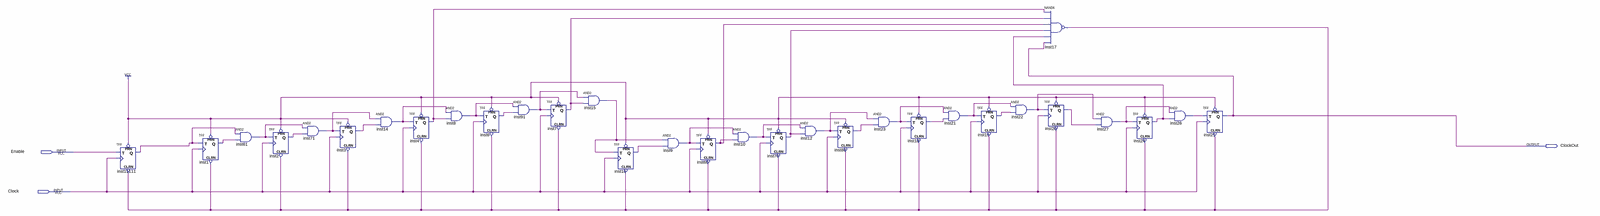
[diagram p0: schematic sheet, whole]
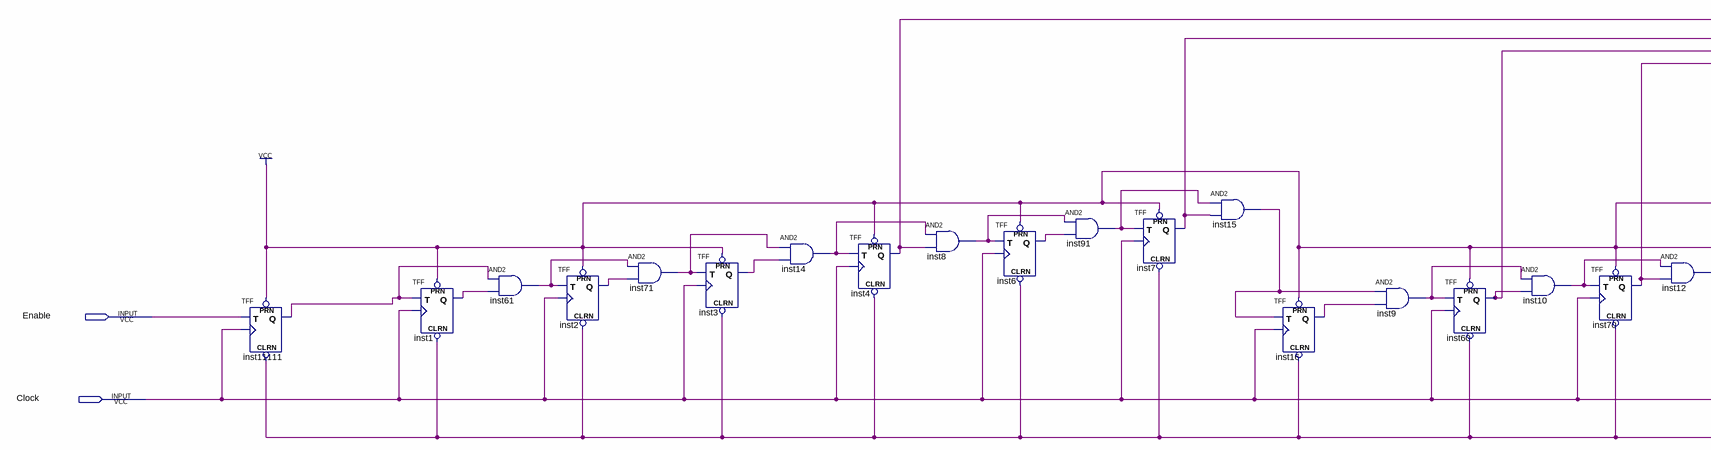
[diagram p1: schematic sheet, left part]
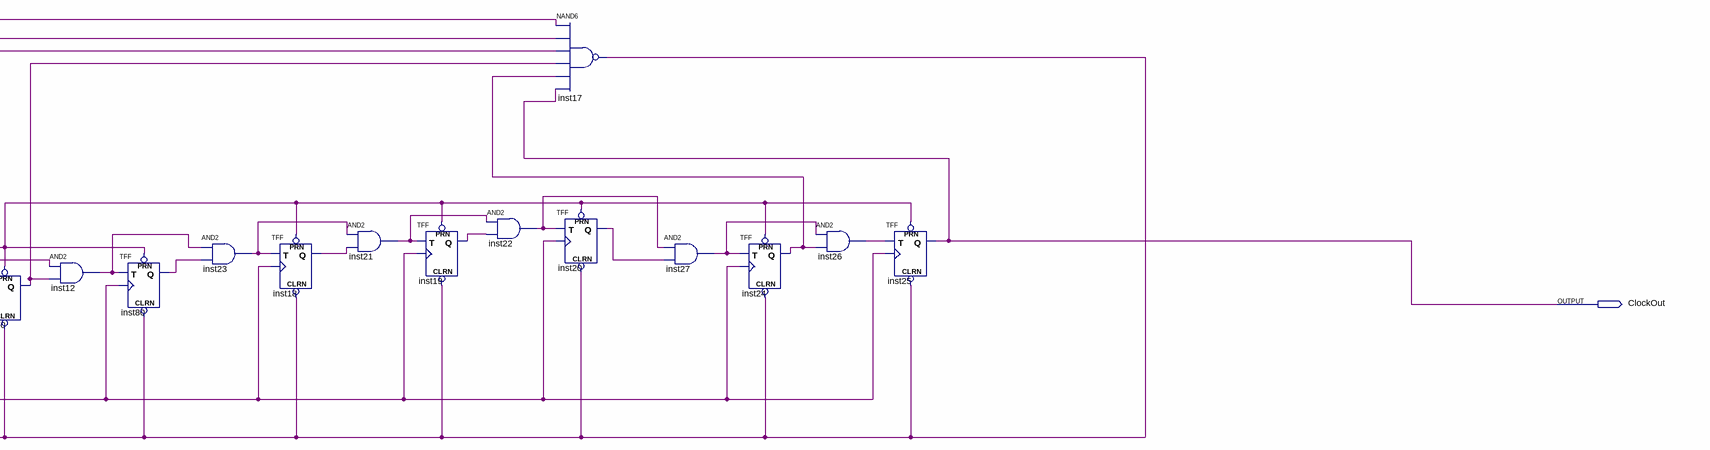
[diagram p2: schematic sheet, right part]
// Quartus schematic divideByFiftyThousandCounter.bdf as structural Verilog: 31 symbols, 3 pins
module divideByFiftyThousandCounter (
  input  Enable,
  input  Clock,
  output ClockOut
);

  wire inst1_q, inst2_q, inst3_q, inst4_q, inst6_q, inst7_q, inst8_out, inst9_out, inst10_out, inst12_out,
       inst14_out, inst15_out, inst16_q, inst17_out, inst18_q, inst19_q, inst20_q, inst21_out, inst22_out,
       inst23_out, inst24_q, inst26_out, inst27_out, inst60_q, inst61_out, inst70_q, inst71_out, inst80_q,
       inst91_out, inst11111_q;

  TFF inst11111 (.PRN(1'b1), .CLRN(inst17_out), .T(Enable), .CLK(Clock), .Q(inst11111_q));
  TFF inst1 (.PRN(1'b1), .CLRN(inst17_out), .T(inst11111_q), .CLK(Clock), .Q(inst1_q));
  and inst61 (inst61_out, inst11111_q, inst1_q);
  TFF inst2 (.PRN(1'b1), .CLRN(inst17_out), .T(inst61_out), .CLK(Clock), .Q(inst2_q));
  and inst71 (inst71_out, inst61_out, inst2_q);
  TFF inst3 (.PRN(1'b1), .CLRN(inst17_out), .T(inst71_out), .CLK(Clock), .Q(inst3_q));
  and inst14 (inst14_out, inst71_out, inst3_q);
  TFF inst4 (.PRN(1'b1), .CLRN(inst17_out), .T(inst14_out), .CLK(Clock), .Q(inst4_q));
  and inst8 (inst8_out, inst14_out, inst4_q);
  TFF inst6 (.PRN(1'b1), .CLRN(inst17_out), .T(inst8_out), .CLK(Clock), .Q(inst6_q));
  and inst91 (inst91_out, inst8_out, inst6_q);
  TFF inst7 (.PRN(1'b1), .CLRN(inst17_out), .T(inst91_out), .CLK(Clock), .Q(inst7_q));
  and inst15 (inst15_out, inst91_out, inst7_q);
  TFF inst16 (.PRN(1'b1), .CLRN(inst17_out), .T(inst15_out), .CLK(Clock), .Q(inst16_q));
  and inst9 (inst9_out, inst15_out, inst16_q);
  TFF inst60 (.PRN(1'b1), .CLRN(inst17_out), .T(inst9_out), .CLK(Clock), .Q(inst60_q));
  and inst10 (inst10_out, inst9_out, inst60_q);
  TFF inst70 (.PRN(1'b1), .CLRN(inst17_out), .T(inst10_out), .CLK(Clock), .Q(inst70_q));
  and inst12 (inst12_out, inst10_out, inst70_q);
  TFF inst80 (.PRN(1'b1), .CLRN(inst17_out), .T(inst12_out), .CLK(Clock), .Q(inst80_q));
  and inst23 (inst23_out, inst12_out, inst80_q);
  TFF inst18 (.PRN(1'b1), .CLRN(inst17_out), .T(inst23_out), .CLK(Clock), .Q(inst18_q));
  and inst21 (inst21_out, inst23_out, inst18_q);
  TFF inst19 (.PRN(1'b1), .CLRN(inst17_out), .T(inst21_out), .CLK(Clock), .Q(inst19_q));
  and inst22 (inst22_out, inst21_out, inst19_q);
  nand inst17 (inst17_out, inst4_q, inst7_q, inst60_q, inst70_q, inst24_q, ClockOut);
  TFF inst20 (.PRN(1'b1), .CLRN(inst17_out), .T(inst22_out), .CLK(Clock), .Q(inst20_q));
  and inst27 (inst27_out, inst22_out, inst20_q);
  TFF inst24 (.PRN(1'b1), .CLRN(inst17_out), .T(inst27_out), .CLK(Clock), .Q(inst24_q));
  and inst26 (inst26_out, inst27_out, inst24_q);
  TFF inst25 (.PRN(1'b1), .CLRN(inst17_out), .T(inst26_out), .CLK(Clock), .Q(ClockOut));
endmodule
